# Altium schematic sheet H-Bridge Driver.SchDoc
size A4; SheetNumber: 5; SheetTotal: 7
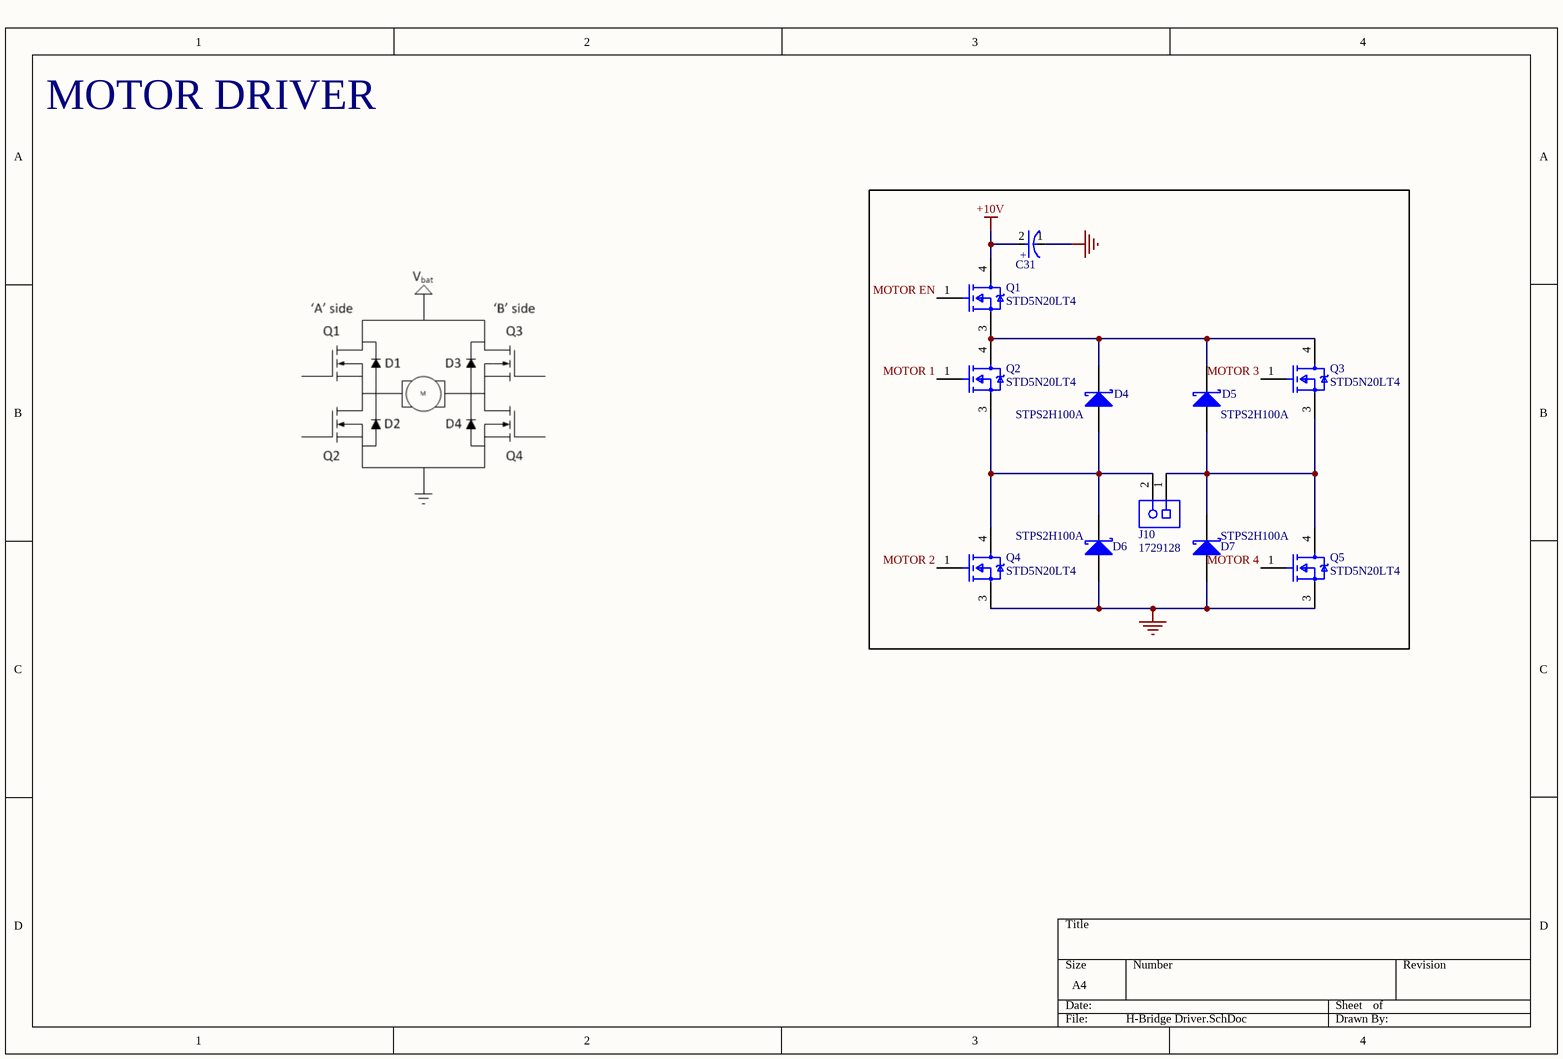
[diagram p0: H-Bridge Driver.SchDoc]

## Parts
C31  EEE-1AA102P  [FP-SG-MFG]  (value not drawn)
D4  STPS2H100A  [STM-SMA-2_V]
D5  STPS2H100A  [STM-SMA-2_V]
D6  STPS2H100A  [STM-SMA-2_V]
D7  STPS2H100A  [STM-SMA-2_V]
J10  1729128  [PHOE-1729128-2_V]
Q1  STD5N20LT4  [FP-DPAK-P032P-MFG]
Q2  STD5N20LT4  [FP-DPAK-P032P-MFG]
Q3  STD5N20LT4  [FP-DPAK-P032P-MFG]
Q4  STD5N20LT4  [FP-DPAK-P032P-MFG]
Q5  STD5N20LT4  [FP-DPAK-P032P-MFG]

## Nets
+10V: C31.2(A) Q1.4(D)
GND: C31.1(C) D6.1(A) D7.1(A) Q4.3(S) Q5.3(S)
MOTOR 1: Q2.1(G)
MOTOR 2: Q4.1(G)
MOTOR 3: Q3.1(G)
MOTOR 4: Q5.1(G)
MOTOR EN: Q1.1(G)
NetD4_1: D4.1(A) D6.2(K) J10.2 Q2.3(S) Q4.4(D)
NetD4_2: D4.2(K) D5.2(K) Q1.3(S) Q2.4(D) Q3.4(D)
NetD5_1: D5.1(A) D7.2(K) J10.1 Q3.3(S) Q5.4(D)

## Notes on the sheet
- MOTOR DRIVER
- (in symbol CMP-00287-55501125-1) +

## Library data of the parts
C31 = CMP-00287-55501125-1: EEE-1AA102P Aluminum Electrolytic Capacitor, 1000 uF, 10 V, ± 20%, 2000 hours @ 85°C, Radial Can - SMD; Leakage Current: 3µA; Ripple Current (AC): 580mA; Capacitance: 1mF; Voltage: 10V; NexarPartId: 55501125; REACH SVHC: Unknown; Length: 10.5mm; Case/Package: Radial; Height - Seated (Max): 10.2108mm; Min Operating Temperature: -40°C; Packaging: Cut Tape; Contact Plating: Tin; Height: 10.2mm; Schedule B: 8532220020, 8532220020; RoHS: Compliant; Radiation Hardening: No; Mount: PCB, Surface Mount; Max Operating Temperature: 85°C; Voltage Rating (DC): 10V; Life (Hours): 2000hours; Voltage Rating: 10V; Ripple Current: 580mA; Lifecycle Status: Production; Termination: SMD/SMT; Lead Free: Lead Free; Diameter: 10mm; Tolerance: 20%
D4-D7 = CMP-2000-07175-1: Power Schottky Rectifier, 2 A, 100 V, 2-Pin SMD (SMA), RoHS, Tape and Reel; Manufacturer: STMicroelectronics; Other Related Documents: STPS2H100ViewAllSpecifications; Voltage - Forward (Vf) (Max) @ If: 790mV@2A; Current - Average Rectified (Io): 2A; Online Catalog: SchottkyDiode; Voltage - DC Reverse (Vr) (Max): 100V; Other Names: 497-3758-6; Speed: FastRecovery=200mA(Io); Current - Reverse Leakage @ Vr: 1µA@100V; Series: -; Datasheet Version: 06/2013; Manufacturer URL: http://www.st.com/; Diode Type: Schottky; Standard Package: 1; Package URL: http://www.st.com/st-web-ui/static/active/en/resource/technical/document/datasheet/CD00283518.pdf; Category: DiscreteSemiconductorProducts; Operating Temperature - Junction: 175°C(Max); Package / Case: DO-214AC,SMA; Package Description: 2-Pin Surface Mount Device, Body 4.275 x 2.575 mm; Mounting Type: SurfaceMount; Family: Diodes,Rectifiers-Single; Reverse Recovery Time (trr): -; Package Reference: SMA; Mounting Technology: SurfaceMount; Packaging: Digi-Reel®; Capacitance @ Vr, F: -; Supplier Device Package: SMA(DO-214AC); Datasheet URL: http://www.st.com/content/ccc/resource/technical/document/datasheet/0a/8b/df/ef/15/72/4f/38/CD00001548.pdf/files/CD00001548.pdf/jcr:content/translations/en.CD00001548.pdf
J10 = CMP-2000-05815-1: PCB Terminal Block, 13.5 A, 400 V, 2-Pin THD, RoHS, Bulk; Manufacturer: Phoenix Contact; Package Version: 03/2015; No. of Rows: 1; Pitch: 5.08mm; No. of Positions: 2; Voltage Rating: 400V; Current Rating: 13500mA; Manufacturer URL: http://www.phoenixcontact.com/; Datasheet URL: https://datasheet.ciiva.com/16046/1729128-16046181.pdf; RoHS: TRUE; Package URL: https://www.phoenixcontact.com/online/portal/pi/pxc/product_detail_page/!ut/p/b1/3VdJjqNKFDxLH8AFycySyWY2ozFsEPOMMQaDOX1XedGL_1Vdm5YXJleknhSKeBkvI6EA8ncAo3AYoDhBQGco6KN7VURTdemj9us_IEKEZo_YHiPAEWEFmDGOHMORkqKYCORBZxgL7ZoaZYcbFFUZ3fqxSY6GOuxydWUuHqz1ynmMFygu583Bob0Ewr6Sd_l-5m-kAueHiB0jpRwZwe58wwtkpxtMYd_LmGcDRU02dRNEyWt6Y2ti5pSyJ_reIkzIulrqApdnbT11V5jnCKbYNCvhEM1MCpPByat_X379-iThf08CI5GfOPqfBeS3BRoBOdD55AKVv0iLwCMq-2BrzXWSGRH7pUGD9uwXQjiph3xL0DKQwdGa0JImiIOmBNOestqgwTHSSs2oOep-78apyXQBvNi8ZLaFjvjWvcaUEBu0MC6Wbe-d6mB0FAebo2lUWinqYaZs5DAYzV0RP9yitUjnGJ0iI9xhZkT42OCQNUJJhkgWINNQLP2JFP6OpMg3JCVg70jqHT0lvKOnhHf0lPuOnnLf0VPuWx6_dxwUIvwk5WMkT0kLL1mh61l2yZVSzG3pYV_bqo-mj6uMKwKwdnnW8Jh5RTOJzMOA5c-eJDaZQw4mTMPH02PvS_ZAqNVjVTo2WyYLkwH_KU1mmmG5kjRhDqPXLwwVHvVOjCM60-fpXvTDfMGW1PVFVS1r4e4yVDk4ZdNbkUHvqPqQSeian4UD39fNKmachqdJ1NJbyk8rXT9mXTvPk3oE5meulKGgiruPJek-4I9hTT6G8ZLOyRSm2RRVbThERQad5OS28hdt4YW4vG0stgYYzsWsK4_7y6DZMjJSCqri1kyiZR5vD7pwIrNR7QwPHTcLTI5qT7eRlpHrdGiupYlqQDJ7zy_CND8fWWBoLRXxk1RVcXiBQwbTD4Xi7KL-FuO94t9xaqweXzH; PartNumber: 1729128; Package Description: 2-Pin Through Hole Device, Body 8.1 x 10.16 mm, Pitch 5.08 mm; Datasheet Version: 12/2013; Mounting Technology: ThroughHole; Orientation: Horizontal; Package Reference: 1729128-2; Packing: Bulk
Q1-Q5 = CMP-12198-000019-1: MOSFET N-CH 200V 5A DPAK; Manufacturer: STMicroelectronics; Threshold Vgs Min: 1V; Turn On Delay Time: 11.5ns; Number Of N Channels: 1; Input Capacitace At Vds: 242pF @ 25V; Standoff Height: 0.03mm; Rthja Max: 100°C/W; Max Junction Temp: +150°C; Gate Charge At Vgs: 5nC @ 5V; Threshold Vgs Max: 2.5V; Depletion Mode: False; Reverse Recovery Time: 93ns; Gate To Source Voltage: 20V; Reverse Recovery Charge: 237nC; Max Forward Diode Voltage: 1.5V; Drain To Source Resistance: 0.65Ω; Transconductance: 6.5S; Power Dissipation: 33W; Pulse Drain Current: 20A; Turn Off Delay Time: 14ns; Temperature Range High: +150°C; Manufacturer Part Number: STD5N20LT4; Lead Free: Yes; ComponentLink2URL: https://www.st.com/resource/en/datasheet/std5n20l.pdf; Package: DPAK-P032P; Device Class L1: Discrete Semiconductors; Device Class L3: MOSFETs; Number Of Channels: 1; Digikey Description: MOSFET N-CH 200V 5A DPAK; Mouser Description: MOSFET Transistor, N Channel, 2.5 A, 200 V, 650 mohm, 5 V, 2.5 V RoHS Compliant: Yes; Height: 2.63mm; Temperature Range Low: -55°C; Temperature: -55°C to +150°C; ComponentLink2Description: Datasheet; Category: Trans; RoHS: TRUE; Continuous Drain Current: 5A; Automotive: No; Drain To Source Breakdown Voltage: 200V; Device Class L2: Transistors; Drain To Source Voltage: 200V; Octopart: https://octopart.com/std5n20lt4-stmicroelectronics-335491